# EAGLE design AAT1217_BREAKOUT (EAGLE 7.2.0)
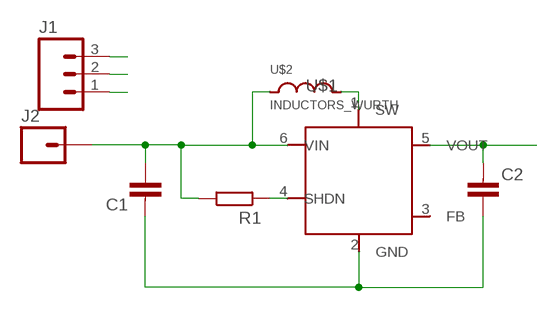
[diagram p0: schematic, sheet 1]

## Parts
C1  CAPACITOR0603-N  [C0603-N]
C2  CAPACITOR0603-N  [C0603-N]
J1  M03PTH  [1X03]
J2  M01SMD  [LUXEON-PAD]
R1  RESISTOR0603-N  [R0603-N]
U$1  AAT1217  [SOT23-6]
U$2  INDUCTORS_WURTH  [WURTH_10UH_650MA]

## Nets
GND: C1.1 C2.2 J1.1 U$1.2(GND)
N$1: R1.1 U$1.4(SHDN)
N$2: C1.2 J2.P$1 R1.2 U$1.6(VIN) U$2.P$2
N$4: U$1.1(SW) U$2.P$1
N$8: J1.2
VOUT: C2.1 J1.3 U$1.5(VOUT)
Unconnected: U$1.3(FB)

## Library data of the parts
C1 C2 = passives-7351:CAPACITOR
J1 = SparkFun-Connectors:M03: Header 3 Standard 3-pin 0.1" header. Use with straight break away headers (SKU : PRT-00116), right angle break away headers (PRT-00553), swiss pins (PRT-00743), machine pins (PRT-00117), and female headers (PRT-00115). Molex polarized connector foot print use with SKU : PRT-08232 with associated crimp pins and housings.
J2 = SparkFun-Connectors:M01: Header 1 Standard 1-pin 0.1" header. Use with straight break away headers (SKU : PRT-00116), right angle break away headers (PRT-00553), swiss pins (PRT-00743), machine pins (PRT-00117), and female headers (PRT-00115). SMTSO-256-ET is a "flush mount" nut for a 4-40 screw. The older package used to be too tight, and did not allow it to sit properly thru the drill hit. The latest (0.165DIA) fits nice and snug.
R1 = passives-7351:RESISTOR
U$1 = _my-parts:AAT1217
U$2 = _my-parts:INDUCTORS

## Board
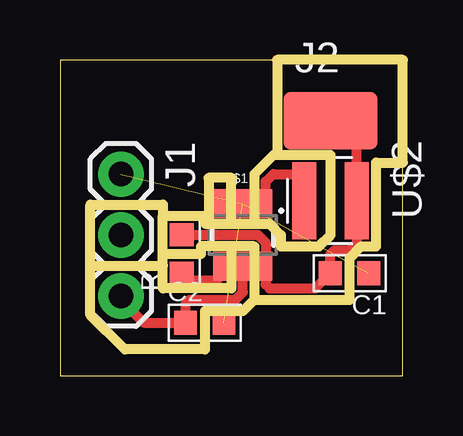
[diagram p1: board, top side]

Size 14.28 x 13.17 mm. Coordinates in mm from the lower left corner, seen from the top.
Outline: 0,0 14.28,0 14.28,13.17 0,13.17 0,0
Copper layers (1*16): Top 0.035mm / dielectric 1.5mm / Bottom 0.035mm
Design rules "default": minimum track width 10mil, minimum drill 24mil, track to track 8mil, track to pad 8mil, pad to pad 8mil, via to via 8mil, smd to smd 8mil, copper to edge 40mil, drill to drill 8mil, minimum pad ring 10mil, minimum via ring 8mil, stop-mask expansion 4mil, vias tented up to drill 0mil, thermal gap 10mil
Milling: 47 lines

### Footprints (pad centres in the part's own frame; a part is rotated, then mirrored left to right if it is on the bottom)
C0603-N = smd 0.95 x 1: 1 -0.8,0; 2 0.8,0
1X03 = drill 1.016 pad 1.88: 1 0,0; 2 2.54,0; 3 5.08,0
LUXEON-PAD = smd 3.9 x 2.4: P$1 0,0
R0603-N = smd 0.95 x 1: 1 -0.8,0; 2 0.8,0
SOT23-6 = smd 0.55 x 1.2: 1 0.95,1.3; 2 0,1.3; 3 -0.95,1.3; 4 -0.95,-1.3; 5 0,-1.3; 6 0.95,-1.3
WURTH_10UH_650MA = smd 3.2 x 1: P$1 0,-1.1; P$2 0,1.1

### Placement (x,y rotation side)
C1  12.06,4.29 180 top
C2  6.03,2.22 0 top
J1  2.54,8.41 270 top
J2  11.27,10.64 0 top
R1  5.08,5.08 90 top
U$1  7.62,5.87 0 top
U$2  11.27,7.3 270 top

### Tracks (layer width: path | path; a pad name or v marks a point on that pad's centre or on a via)
GND  (3 unrouted)
N$1
  Top 0.406: U$1.4 6.67,4.13 6.51,3.97 5.39,3.97 R1.1
N$2
  Top 0.406: R1.2 8.25,5.88 8.57,5.56 U$1.6 8.57,3.81 8.73,3.65 10.63,3.65 C1.2 11.27,5.07 11.43,5.24 12.06,5.24 12.38,5.56 12.38,7.29 U$2.P$2 12.37,9.54 J2.P$1
N$4
  Top 0.406: U$1.1 8.57,8.09 8.89,8.41 10.16,8.41 10.16,7.31 U$2.P$1
VOUT
  Top 0.406: J1.3 2.54,3.17 3.49,2.22 C2.1 5.23,3.01 5.4,3.17 7.3,3.17 7.62,3.49 U$1.5